# Altium schematic sheet AHT10_SENSOR_2023-11-20.schdoc
size 55 x 38 mm
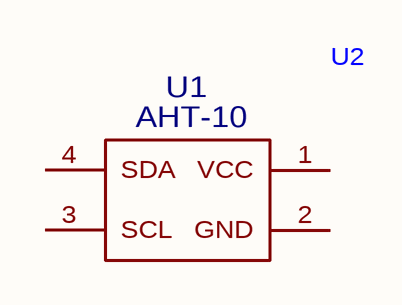
[diagram p0: AHT10_SENSOR_2023-11-20.schdoc]

## Parts
U2  (no value)  [AHT10_BREAKOUT]

## Nets

Not connected (* = marked no-connect by the designer): U2 1(VCC) 2(GND) 3(SCL) 4(SDA)

## Notes on the sheet
- (in symbol AHT10_SENSOR) U1; AHT-10

## Library data of the parts
U2 = AHT10_SENSOR